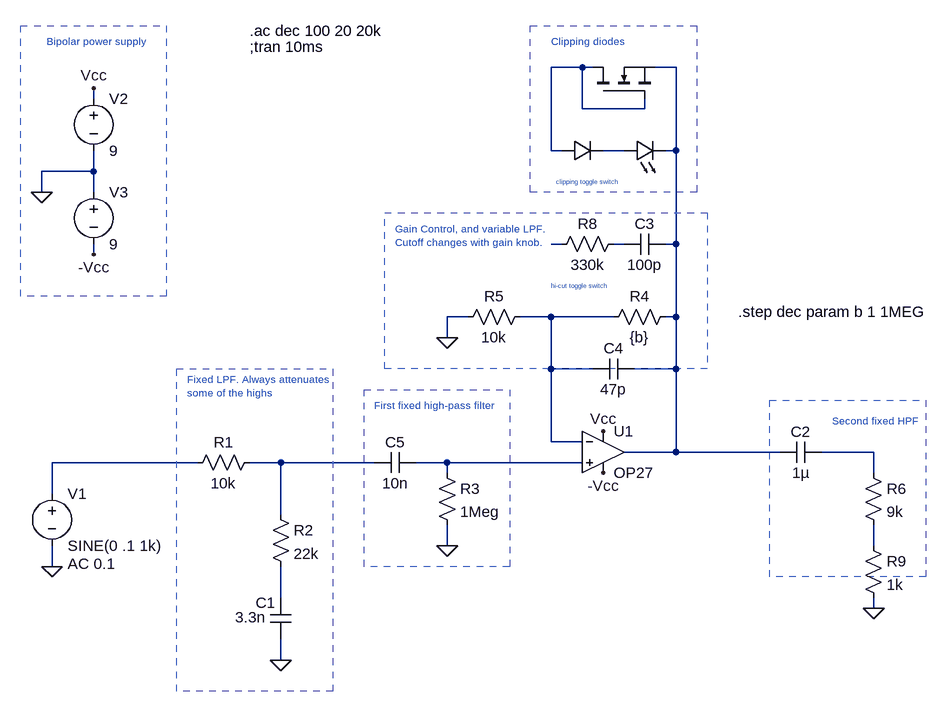
[diagram p0: schematic OpAmpBoost.asc]
OpAmpBoost.asc, the LTspice schematic file:
Version 4
SHEET 1 1024 680
WIRE 240 -496 192 -496
WIRE 256 -496 240 -496
WIRE 384 -496 352 -496
WIRE -512 -448 -512 -464
WIRE 240 -432 240 -496
WIRE 336 -432 336 -448
WIRE 336 -432 240 -432
WIRE 192 -368 192 -496
WIRE 208 -368 192 -368
WIRE 304 -368 272 -368
WIRE 384 -368 384 -496
WIRE 384 -368 368 -368
WIRE -512 -336 -512 -368
WIRE -512 -336 -592 -336
WIRE -592 -304 -592 -336
WIRE -512 -304 -512 -336
WIRE 208 -224 192 -224
WIRE 304 -224 288 -224
WIRE 384 -224 384 -368
WIRE 384 -224 368 -224
WIRE -512 -208 -512 -224
WIRE 64 -112 32 -112
WIRE 192 -112 144 -112
WIRE 288 -112 192 -112
WIRE 384 -112 384 -224
WIRE 384 -112 368 -112
WIRE 32 -80 32 -112
WIRE 192 -32 192 -112
WIRE 256 -32 192 -32
WIRE 384 -32 384 -112
WIRE 384 -32 320 -32
WIRE 192 80 192 -32
WIRE 240 80 192 80
WIRE 384 96 384 -32
WIRE 384 96 304 96
WIRE 544 96 384 96
WIRE 688 96 608 96
WIRE -352 112 -576 112
WIRE -224 112 -272 112
WIRE -80 112 -224 112
WIRE 32 112 -16 112
WIRE 240 112 32 112
WIRE 32 128 32 112
WIRE 688 128 688 96
WIRE -576 160 -576 112
WIRE -224 192 -224 112
WIRE 32 240 32 208
WIRE 688 240 688 208
WIRE -576 272 -576 240
WIRE -224 320 -224 272
WIRE 688 336 688 320
WIRE -224 416 -224 384
FLAG -576 272 0
FLAG -592 -304 0
FLAG -512 -464 Vcc
FLAG 272 64 Vcc
FLAG 688 336 0
FLAG -512 -208 -Vcc
FLAG 32 240 0
FLAG 272 128 -Vcc
FLAG -224 416 0
FLAG 32 -80 0
SYMBOL voltage -576 144 R0
WINDOW 123 24 124 Left 2
WINDOW 39 24 152 Left 2
SYMATTR Value2 AC 0.1
SYMATTR InstName V1
SYMATTR Value SINE(0 .1 1k)
SYMBOL voltage -512 -464 R0
WINDOW 123 0 0 Left 2
WINDOW 39 0 0 Left 2
SYMATTR InstName V2
SYMATTR Value 9
SYMBOL res 16 112 R0
SYMATTR InstName R3
SYMATTR Value 1Meg
SYMBOL res 384 -128 R90
WINDOW 0 0 56 VBottom 2
WINDOW 3 32 56 VTop 2
SYMATTR InstName R4
SYMATTR Value {b}
SYMBOL res 160 -128 R90
WINDOW 0 0 56 VBottom 2
WINDOW 3 32 56 VTop 2
SYMATTR InstName R5
SYMATTR Value 10k
SYMBOL res 672 112 R0
SYMATTR InstName R6
SYMATTR Value 9k
SYMBOL cap 608 80 R90
WINDOW 0 0 32 VBottom 2
WINDOW 3 32 32 VTop 2
SYMATTR InstName C2
SYMATTR Value 1µ
SYMBOL Opamps\\OP27 272 32 R0
SYMATTR InstName U1
SYMBOL voltage -512 -320 R0
WINDOW 123 0 0 Left 2
WINDOW 39 0 0 Left 2
SYMATTR InstName V3
SYMATTR Value 9
SYMBOL LED 304 -352 R270
WINDOW 0 72 32 Invisible 2
WINDOW 3 0 32 Invisible 2
SYMATTR InstName D1
SYMATTR Value NSPW500BS
SYMATTR Description Diode
SYMATTR Type diode
SYMBOL nmos 256 -448 R270
WINDOW 0 56 32 Invisible 2
WINDOW 3 56 72 Invisible 2
SYMATTR InstName M1
SYMBOL cap 368 -240 R90
WINDOW 0 0 32 VBottom 2
WINDOW 3 32 32 VTop 2
SYMATTR InstName C3
SYMATTR Value 100p
SYMBOL res -256 96 R90
WINDOW 0 0 56 VBottom 2
WINDOW 3 32 56 VTop 2
SYMATTR InstName R1
SYMATTR Value 10k
SYMBOL cap -16 96 R90
WINDOW 0 0 32 VBottom 2
WINDOW 3 32 32 VTop 2
SYMATTR InstName C5
SYMATTR Value 10n
SYMBOL cap -208 384 R180
WINDOW 0 24 56 Left 2
WINDOW 3 39 34 Left 2
SYMATTR InstName C1
SYMATTR Value 3.3n
SYMBOL res -240 176 R0
SYMATTR InstName R2
SYMATTR Value 22k
SYMBOL res 304 -240 R90
WINDOW 0 0 56 VBottom 2
WINDOW 3 32 56 VTop 2
SYMATTR InstName R8
SYMATTR Value 330k
SYMBOL res 672 224 R0
SYMATTR InstName R9
SYMATTR Value 1k
SYMBOL diode 208 -352 R270
WINDOW 0 72 32 Invisible 2
WINDOW 3 0 32 Invisible 2
SYMATTR InstName D2
SYMATTR Value 1N914
SYMBOL cap 320 -48 R90
WINDOW 0 0 32 VBottom 2
WINDOW 3 32 32 VTop 2
SYMATTR InstName C4
SYMATTR Value 47p
TEXT -272 -528 Left 2 !;tran 10ms
TEXT -272 -552 Left 2 !.ac dec 100 20 20k
TEXT 480 -120 Left 2 !.step dec param b 1 1MEG
TEXT -368 -16 Left 1 ;Fixed LPF. Always attenuates\nsome of the highs
TEXT -80 24 Left 1 ;First fixed high-pass filter
TEXT 192 -536 Left 1 ;Clipping diodes
TEXT -48 -248 Left 1 ;Gain Control, and variable LPF.\nCutoff changes with gain knob.
TEXT 624 48 Left 1 ;Second fixed HPF
TEXT -584 -536 Left 1 ;Bipolar power supply
TEXT 200 -320 Left 0 ;clipping toggle switch
TEXT 192 -160 Left 0 ;hi-cut toggle switch
RECTANGLE Normal -144 464 -384 -32 2
RECTANGLE Normal 128 272 -96 0 2
RECTANGLE Normal 432 -32 -64 -272 2
RECTANGLE Normal 416 -304 160 -560 2
RECTANGLE Normal 768 288 528 16 2
RECTANGLE Normal -400 -144 -624 -560 2

The netlist it stands for:
* OpAmpBoost.asc
V1 N008 0 SINE(0 .1 1k) AC 0.1
V2 Vcc 0 9
R3 N010 0 1Meg
R4 N002 N006 {b}
R5 N006 0 10k
R6 N007 N011 9k
C2 N007 N002 1µ
XU1 N010 N006 Vcc -Vcc N002 OP27  ; pins In+ In- V+ V- OUT
V3 0 -Vcc 9
D1 N003 N002 NSPW500BS
M1 N001 N001 N002 N002 NMOS
C3 N002 N005 100p
R1 N009 N008 10k
C5 N010 N009 10n
C1 0 N012 3.3n
R2 N009 N012 22k
R8 N005 N004 330k
R9 N011 0 1k
D2 N001 N003 1N914
C4 N002 N006 47p
.model D D
.lib standard.dio
.model NMOS NMOS
.model PMOS PMOS
.lib standard.mos
;tran 10ms
.ac dec 100 20 20k
.step dec param b 1 1MEG
* Fixed LPF. Always attenuates
* some of the highs
* First fixed high-pass filter
* Clipping diodes
* Gain Control, and variable LPF.
* Cutoff changes with gain knob.
* Second fixed HPF
* Bipolar power supply
* clipping toggle switch
* hi-cut toggle switch
.lib ADI.lib
.backanno
.end